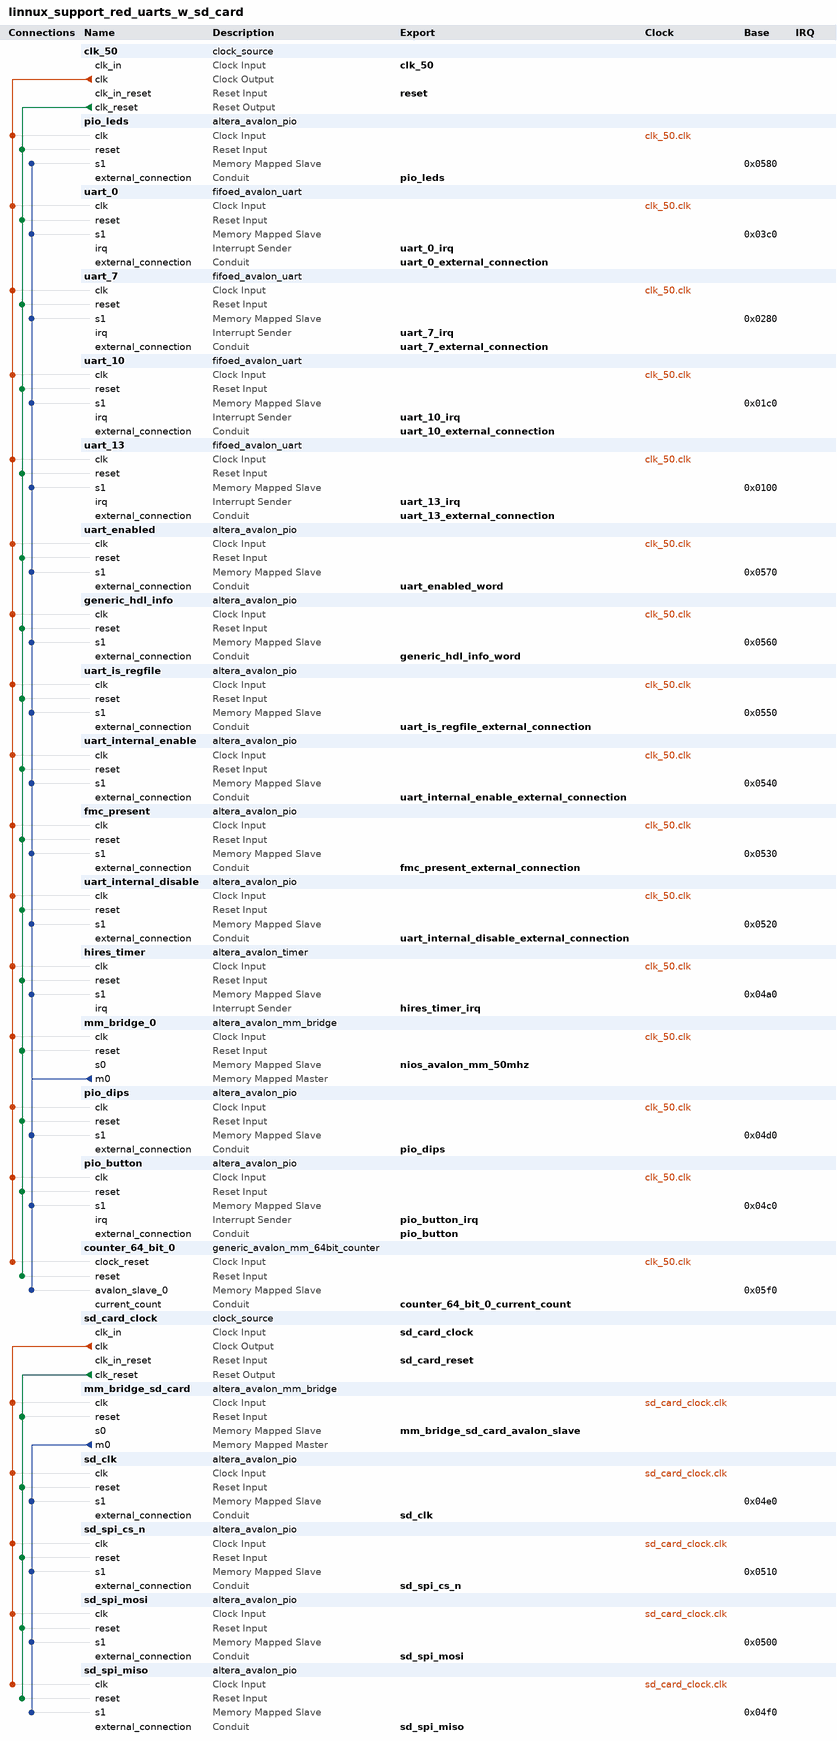
[diagram p0: system contents]
# Platform Designer (Qsys) system linnux_support_red_uarts_w_sd_card, Stratix IV EP4SGX530KH40C2
# Parameters at their usual value, and those the tool derives, are not listed.
package require -exact qsys 16.1
create_system linnux_support_red_uarts_w_sd_card
set_project_property DEVICE_FAMILY {Stratix IV}
set_project_property DEVICE EP4SGX530KH40C2

add_instance clk_50 clock_source 16.1
set_instance_parameter_value clk_50 clockFrequency 50000000
set_instance_parameter_value clk_50 resetSynchronousEdges BOTH

add_instance pio_leds altera_avalon_pio 16.1
set_instance_parameter_value pio_leds direction Output
set_instance_parameter_value pio_leds width 9

add_instance uart_0 fifoed_avalon_uart 13.1
set_instance_parameter_value uart_0 add_error_bits false
set_instance_parameter_value uart_0 baud 2000000
set_instance_parameter_value uart_0 dataBits 8
set_instance_parameter_value uart_0 driver_pass_error_bits false
set_instance_parameter_value uart_0 export_handshake false
set_instance_parameter_value uart_0 fifo_export_used false
set_instance_parameter_value uart_0 fifo_size_rx 128
set_instance_parameter_value uart_0 fifo_size_tx 128
set_instance_parameter_value uart_0 fixedBaud false
set_instance_parameter_value uart_0 gap_value 4
set_instance_parameter_value uart_0 hw_cts false
set_instance_parameter_value uart_0 parity NONE
set_instance_parameter_value uart_0 rx_IRQ_Threshold 1
set_instance_parameter_value uart_0 rx_fifo_LE false
set_instance_parameter_value uart_0 simInteractiveInputEnable false
set_instance_parameter_value uart_0 simInteractiveOutputEnable false
set_instance_parameter_value uart_0 simTrueBaud false
set_instance_parameter_value uart_0 stopBits 1
set_instance_parameter_value uart_0 syncRegDepth 2
set_instance_parameter_value uart_0 timeout_value 20
set_instance_parameter_value uart_0 timestamp_width 8
set_instance_parameter_value uart_0 trans_pin false
set_instance_parameter_value uart_0 tx_IRQ_Threshold 1
set_instance_parameter_value uart_0 tx_fifo_LE false
set_instance_parameter_value uart_0 useCtsRts false
set_instance_parameter_value uart_0 useEopRegister false
set_instance_parameter_value uart_0 useRelativePathForSimFile false
set_instance_parameter_value uart_0 use_ext_timestamp false
set_instance_parameter_value uart_0 use_gap_detection false
set_instance_parameter_value uart_0 use_rx_fifo true
set_instance_parameter_value uart_0 use_status_bit_clear false
set_instance_parameter_value uart_0 use_timestamp false
set_instance_parameter_value uart_0 use_timout false
set_instance_parameter_value uart_0 use_tx_fifo true

add_instance uart_7 fifoed_avalon_uart 13.1
set_instance_parameter_value uart_7 add_error_bits false
set_instance_parameter_value uart_7 baud 2000000
set_instance_parameter_value uart_7 dataBits 8
set_instance_parameter_value uart_7 driver_pass_error_bits false
set_instance_parameter_value uart_7 export_handshake false
set_instance_parameter_value uart_7 fifo_export_used false
set_instance_parameter_value uart_7 fifo_size_rx 128
set_instance_parameter_value uart_7 fifo_size_tx 128
set_instance_parameter_value uart_7 fixedBaud true
set_instance_parameter_value uart_7 gap_value 4
set_instance_parameter_value uart_7 hw_cts false
set_instance_parameter_value uart_7 parity NONE
set_instance_parameter_value uart_7 rx_IRQ_Threshold 1
set_instance_parameter_value uart_7 rx_fifo_LE false
set_instance_parameter_value uart_7 simInteractiveInputEnable false
set_instance_parameter_value uart_7 simInteractiveOutputEnable false
set_instance_parameter_value uart_7 simTrueBaud false
set_instance_parameter_value uart_7 stopBits 1
set_instance_parameter_value uart_7 syncRegDepth 2
set_instance_parameter_value uart_7 timeout_value 20
set_instance_parameter_value uart_7 timestamp_width 8
set_instance_parameter_value uart_7 trans_pin false
set_instance_parameter_value uart_7 tx_IRQ_Threshold 1
set_instance_parameter_value uart_7 tx_fifo_LE false
set_instance_parameter_value uart_7 useCtsRts false
set_instance_parameter_value uart_7 useEopRegister false
set_instance_parameter_value uart_7 useRelativePathForSimFile false
set_instance_parameter_value uart_7 use_ext_timestamp false
set_instance_parameter_value uart_7 use_gap_detection false
set_instance_parameter_value uart_7 use_rx_fifo true
set_instance_parameter_value uart_7 use_status_bit_clear false
set_instance_parameter_value uart_7 use_timestamp false
set_instance_parameter_value uart_7 use_timout false
set_instance_parameter_value uart_7 use_tx_fifo true

add_instance uart_10 fifoed_avalon_uart 13.1
set_instance_parameter_value uart_10 add_error_bits false
set_instance_parameter_value uart_10 baud 2000000
set_instance_parameter_value uart_10 dataBits 8
set_instance_parameter_value uart_10 driver_pass_error_bits false
set_instance_parameter_value uart_10 export_handshake false
set_instance_parameter_value uart_10 fifo_export_used false
set_instance_parameter_value uart_10 fifo_size_rx 128
set_instance_parameter_value uart_10 fifo_size_tx 128
set_instance_parameter_value uart_10 fixedBaud true
set_instance_parameter_value uart_10 gap_value 4
set_instance_parameter_value uart_10 hw_cts false
set_instance_parameter_value uart_10 parity NONE
set_instance_parameter_value uart_10 rx_IRQ_Threshold 1
set_instance_parameter_value uart_10 rx_fifo_LE false
set_instance_parameter_value uart_10 simInteractiveInputEnable false
set_instance_parameter_value uart_10 simInteractiveOutputEnable false
set_instance_parameter_value uart_10 simTrueBaud false
set_instance_parameter_value uart_10 stopBits 1
set_instance_parameter_value uart_10 syncRegDepth 2
set_instance_parameter_value uart_10 timeout_value 20
set_instance_parameter_value uart_10 timestamp_width 8
set_instance_parameter_value uart_10 trans_pin false
set_instance_parameter_value uart_10 tx_IRQ_Threshold 1
set_instance_parameter_value uart_10 tx_fifo_LE false
set_instance_parameter_value uart_10 useCtsRts false
set_instance_parameter_value uart_10 useEopRegister false
set_instance_parameter_value uart_10 useRelativePathForSimFile false
set_instance_parameter_value uart_10 use_ext_timestamp false
set_instance_parameter_value uart_10 use_gap_detection false
set_instance_parameter_value uart_10 use_rx_fifo true
set_instance_parameter_value uart_10 use_status_bit_clear false
set_instance_parameter_value uart_10 use_timestamp false
set_instance_parameter_value uart_10 use_timout false
set_instance_parameter_value uart_10 use_tx_fifo true

add_instance uart_13 fifoed_avalon_uart 13.1
set_instance_parameter_value uart_13 add_error_bits false
set_instance_parameter_value uart_13 baud 2000000
set_instance_parameter_value uart_13 dataBits 8
set_instance_parameter_value uart_13 driver_pass_error_bits false
set_instance_parameter_value uart_13 export_handshake false
set_instance_parameter_value uart_13 fifo_export_used false
set_instance_parameter_value uart_13 fifo_size_rx 128
set_instance_parameter_value uart_13 fifo_size_tx 128
set_instance_parameter_value uart_13 fixedBaud true
set_instance_parameter_value uart_13 gap_value 4
set_instance_parameter_value uart_13 hw_cts false
set_instance_parameter_value uart_13 parity NONE
set_instance_parameter_value uart_13 rx_IRQ_Threshold 1
set_instance_parameter_value uart_13 rx_fifo_LE false
set_instance_parameter_value uart_13 simInteractiveInputEnable false
set_instance_parameter_value uart_13 simInteractiveOutputEnable false
set_instance_parameter_value uart_13 simTrueBaud false
set_instance_parameter_value uart_13 stopBits 1
set_instance_parameter_value uart_13 syncRegDepth 2
set_instance_parameter_value uart_13 timeout_value 20
set_instance_parameter_value uart_13 timestamp_width 8
set_instance_parameter_value uart_13 trans_pin false
set_instance_parameter_value uart_13 tx_IRQ_Threshold 1
set_instance_parameter_value uart_13 tx_fifo_LE false
set_instance_parameter_value uart_13 useCtsRts false
set_instance_parameter_value uart_13 useEopRegister false
set_instance_parameter_value uart_13 useRelativePathForSimFile false
set_instance_parameter_value uart_13 use_ext_timestamp false
set_instance_parameter_value uart_13 use_gap_detection false
set_instance_parameter_value uart_13 use_rx_fifo true
set_instance_parameter_value uart_13 use_status_bit_clear false
set_instance_parameter_value uart_13 use_timestamp false
set_instance_parameter_value uart_13 use_timout false
set_instance_parameter_value uart_13 use_tx_fifo true

add_instance uart_enabled altera_avalon_pio 16.1
set_instance_parameter_value uart_enabled direction Input
set_instance_parameter_value uart_enabled width 32

add_instance generic_hdl_info altera_avalon_pio 16.1
set_instance_parameter_value generic_hdl_info direction Input
set_instance_parameter_value generic_hdl_info width 32

add_instance uart_is_regfile altera_avalon_pio 16.1
set_instance_parameter_value uart_is_regfile direction Input
set_instance_parameter_value uart_is_regfile width 32

add_instance uart_internal_enable altera_avalon_pio 16.1
set_instance_parameter_value uart_internal_enable direction Output
set_instance_parameter_value uart_internal_enable width 32

add_instance fmc_present altera_avalon_pio 16.1
set_instance_parameter_value fmc_present direction Input
set_instance_parameter_value fmc_present width 16

add_instance uart_internal_disable altera_avalon_pio 16.1
set_instance_parameter_value uart_internal_disable direction Output
set_instance_parameter_value uart_internal_disable width 32

add_instance hires_timer altera_avalon_timer 16.1
set_instance_parameter_value hires_timer period 1
set_instance_parameter_value hires_timer periodUnits MSEC

add_instance mm_bridge_0 altera_avalon_mm_bridge 16.1
set_instance_parameter_value mm_bridge_0 ADDRESS_UNITS SYMBOLS
set_instance_parameter_value mm_bridge_0 ADDRESS_WIDTH 27
set_instance_parameter_value mm_bridge_0 DATA_WIDTH 32
set_instance_parameter_value mm_bridge_0 MAX_PENDING_RESPONSES 4
set_instance_parameter_value mm_bridge_0 USE_AUTO_ADDRESS_WIDTH 1

add_instance pio_dips altera_avalon_pio 16.1
set_instance_parameter_value pio_dips direction Input
set_instance_parameter_value pio_dips width 8

add_instance pio_button altera_avalon_pio 16.1
set_instance_parameter_value pio_button captureEdge true
set_instance_parameter_value pio_button direction Input
set_instance_parameter_value pio_button generateIRQ true
set_instance_parameter_value pio_button irqType EDGE
set_instance_parameter_value pio_button width 8

add_instance counter_64_bit_0 generic_avalon_mm_64bit_counter 2.0

add_instance sd_card_clock clock_source 16.1
set_instance_parameter_value sd_card_clock clockFrequency 50000000
set_instance_parameter_value sd_card_clock clockFrequencyKnown false
set_instance_parameter_value sd_card_clock resetSynchronousEdges BOTH

add_instance mm_bridge_sd_card altera_avalon_mm_bridge 16.1
set_instance_parameter_value mm_bridge_sd_card ADDRESS_UNITS SYMBOLS
set_instance_parameter_value mm_bridge_sd_card ADDRESS_WIDTH 27
set_instance_parameter_value mm_bridge_sd_card DATA_WIDTH 32
set_instance_parameter_value mm_bridge_sd_card MAX_PENDING_RESPONSES 4
set_instance_parameter_value mm_bridge_sd_card USE_AUTO_ADDRESS_WIDTH 1

add_instance sd_clk altera_avalon_pio 16.1
set_instance_parameter_value sd_clk direction Output
set_instance_parameter_value sd_clk width 1

add_instance sd_spi_cs_n altera_avalon_pio 16.1
set_instance_parameter_value sd_spi_cs_n direction Output
set_instance_parameter_value sd_spi_cs_n resetValue 1
set_instance_parameter_value sd_spi_cs_n width 1

add_instance sd_spi_mosi altera_avalon_pio 16.1
set_instance_parameter_value sd_spi_mosi direction Output
set_instance_parameter_value sd_spi_mosi resetValue 1
set_instance_parameter_value sd_spi_mosi width 1

add_instance sd_spi_miso altera_avalon_pio 16.1
set_instance_parameter_value sd_spi_miso direction Input
set_instance_parameter_value sd_spi_miso width 1

# connections
add_connection clk_50.clk counter_64_bit_0.clock_reset clock
add_connection clk_50.clk fmc_present.clk clock
add_connection clk_50.clk generic_hdl_info.clk clock
add_connection clk_50.clk hires_timer.clk clock
add_connection clk_50.clk mm_bridge_0.clk clock
add_connection clk_50.clk pio_button.clk clock
add_connection clk_50.clk pio_dips.clk clock
add_connection clk_50.clk pio_leds.clk clock
add_connection clk_50.clk uart_0.clk clock
add_connection clk_50.clk uart_7.clk clock
add_connection clk_50.clk uart_10.clk clock
add_connection clk_50.clk uart_13.clk clock
add_connection clk_50.clk uart_enabled.clk clock
add_connection clk_50.clk uart_internal_disable.clk clock
add_connection clk_50.clk uart_internal_enable.clk clock
add_connection clk_50.clk uart_is_regfile.clk clock
add_connection sd_card_clock.clk mm_bridge_sd_card.clk clock
add_connection sd_card_clock.clk sd_clk.clk clock
add_connection sd_card_clock.clk sd_spi_cs_n.clk clock
add_connection sd_card_clock.clk sd_spi_miso.clk clock
add_connection sd_card_clock.clk sd_spi_mosi.clk clock
add_connection clk_50.clk_reset counter_64_bit_0.reset reset
add_connection clk_50.clk_reset fmc_present.reset reset
add_connection clk_50.clk_reset generic_hdl_info.reset reset
add_connection clk_50.clk_reset hires_timer.reset reset
add_connection clk_50.clk_reset mm_bridge_0.reset reset
add_connection clk_50.clk_reset pio_button.reset reset
add_connection clk_50.clk_reset pio_dips.reset reset
add_connection clk_50.clk_reset pio_leds.reset reset
add_connection clk_50.clk_reset uart_0.reset reset
add_connection clk_50.clk_reset uart_7.reset reset
add_connection clk_50.clk_reset uart_10.reset reset
add_connection clk_50.clk_reset uart_13.reset reset
add_connection clk_50.clk_reset uart_enabled.reset reset
add_connection clk_50.clk_reset uart_internal_disable.reset reset
add_connection clk_50.clk_reset uart_internal_enable.reset reset
add_connection clk_50.clk_reset uart_is_regfile.reset reset
add_connection sd_card_clock.clk_reset mm_bridge_sd_card.reset reset
add_connection sd_card_clock.clk_reset sd_clk.reset reset
add_connection sd_card_clock.clk_reset sd_spi_cs_n.reset reset
add_connection sd_card_clock.clk_reset sd_spi_miso.reset reset
add_connection sd_card_clock.clk_reset sd_spi_mosi.reset reset
add_connection mm_bridge_0.m0 counter_64_bit_0.avalon_slave_0 avalon
set_connection_parameter_value mm_bridge_0.m0/counter_64_bit_0.avalon_slave_0 baseAddress 0x05f0
add_connection mm_bridge_0.m0 fmc_present.s1 avalon
set_connection_parameter_value mm_bridge_0.m0/fmc_present.s1 baseAddress 0x0530
add_connection mm_bridge_0.m0 generic_hdl_info.s1 avalon
set_connection_parameter_value mm_bridge_0.m0/generic_hdl_info.s1 baseAddress 0x0560
add_connection mm_bridge_0.m0 hires_timer.s1 avalon
set_connection_parameter_value mm_bridge_0.m0/hires_timer.s1 baseAddress 0x04a0
add_connection mm_bridge_0.m0 pio_button.s1 avalon
set_connection_parameter_value mm_bridge_0.m0/pio_button.s1 baseAddress 0x04c0
add_connection mm_bridge_0.m0 pio_dips.s1 avalon
set_connection_parameter_value mm_bridge_0.m0/pio_dips.s1 baseAddress 0x04d0
add_connection mm_bridge_0.m0 pio_leds.s1 avalon
set_connection_parameter_value mm_bridge_0.m0/pio_leds.s1 baseAddress 0x0580
add_connection mm_bridge_0.m0 uart_0.s1 avalon
set_connection_parameter_value mm_bridge_0.m0/uart_0.s1 baseAddress 0x03c0
add_connection mm_bridge_0.m0 uart_7.s1 avalon
set_connection_parameter_value mm_bridge_0.m0/uart_7.s1 baseAddress 0x0280
add_connection mm_bridge_0.m0 uart_10.s1 avalon
set_connection_parameter_value mm_bridge_0.m0/uart_10.s1 baseAddress 0x01c0
add_connection mm_bridge_0.m0 uart_13.s1 avalon
set_connection_parameter_value mm_bridge_0.m0/uart_13.s1 baseAddress 0x0100
add_connection mm_bridge_0.m0 uart_enabled.s1 avalon
set_connection_parameter_value mm_bridge_0.m0/uart_enabled.s1 baseAddress 0x0570
add_connection mm_bridge_0.m0 uart_internal_disable.s1 avalon
set_connection_parameter_value mm_bridge_0.m0/uart_internal_disable.s1 baseAddress 0x0520
add_connection mm_bridge_0.m0 uart_internal_enable.s1 avalon
set_connection_parameter_value mm_bridge_0.m0/uart_internal_enable.s1 baseAddress 0x0540
add_connection mm_bridge_0.m0 uart_is_regfile.s1 avalon
set_connection_parameter_value mm_bridge_0.m0/uart_is_regfile.s1 baseAddress 0x0550
add_connection mm_bridge_sd_card.m0 sd_clk.s1 avalon
set_connection_parameter_value mm_bridge_sd_card.m0/sd_clk.s1 baseAddress 0x04e0
add_connection mm_bridge_sd_card.m0 sd_spi_cs_n.s1 avalon
set_connection_parameter_value mm_bridge_sd_card.m0/sd_spi_cs_n.s1 baseAddress 0x0510
add_connection mm_bridge_sd_card.m0 sd_spi_miso.s1 avalon
set_connection_parameter_value mm_bridge_sd_card.m0/sd_spi_miso.s1 baseAddress 0x04f0
add_connection mm_bridge_sd_card.m0 sd_spi_mosi.s1 avalon
set_connection_parameter_value mm_bridge_sd_card.m0/sd_spi_mosi.s1 baseAddress 0x0500

# exported interfaces
add_interface clk_50 clock sink
set_interface_property clk_50 EXPORT_OF clk_50.clk_in
add_interface counter_64_bit_0_current_count conduit end
set_interface_property counter_64_bit_0_current_count EXPORT_OF counter_64_bit_0.current_count
add_interface fmc_present_external_connection conduit end
set_interface_property fmc_present_external_connection EXPORT_OF fmc_present.external_connection
add_interface generic_hdl_info_word conduit end
set_interface_property generic_hdl_info_word EXPORT_OF generic_hdl_info.external_connection
add_interface hires_timer_irq interrupt sender
set_interface_property hires_timer_irq EXPORT_OF hires_timer.irq
add_interface mm_bridge_sd_card_avalon_slave avalon slave
set_interface_property mm_bridge_sd_card_avalon_slave EXPORT_OF mm_bridge_sd_card.s0
add_interface nios_avalon_mm_50mhz avalon slave
set_interface_property nios_avalon_mm_50mhz EXPORT_OF mm_bridge_0.s0
add_interface pio_button conduit end
set_interface_property pio_button EXPORT_OF pio_button.external_connection
add_interface pio_button_irq interrupt sender
set_interface_property pio_button_irq EXPORT_OF pio_button.irq
add_interface pio_dips conduit end
set_interface_property pio_dips EXPORT_OF pio_dips.external_connection
add_interface pio_leds conduit end
set_interface_property pio_leds EXPORT_OF pio_leds.external_connection
add_interface reset reset sink
set_interface_property reset EXPORT_OF clk_50.clk_in_reset
add_interface sd_card_clock clock sink
set_interface_property sd_card_clock EXPORT_OF sd_card_clock.clk_in
add_interface sd_card_reset reset sink
set_interface_property sd_card_reset EXPORT_OF sd_card_clock.clk_in_reset
add_interface sd_clk conduit end
set_interface_property sd_clk EXPORT_OF sd_clk.external_connection
add_interface sd_spi_cs_n conduit end
set_interface_property sd_spi_cs_n EXPORT_OF sd_spi_cs_n.external_connection
add_interface sd_spi_miso conduit end
set_interface_property sd_spi_miso EXPORT_OF sd_spi_miso.external_connection
add_interface sd_spi_mosi conduit end
set_interface_property sd_spi_mosi EXPORT_OF sd_spi_mosi.external_connection
add_interface uart_0_external_connection conduit end
set_interface_property uart_0_external_connection EXPORT_OF uart_0.external_connection
add_interface uart_0_irq interrupt sender
set_interface_property uart_0_irq EXPORT_OF uart_0.irq
add_interface uart_10_external_connection conduit end
set_interface_property uart_10_external_connection EXPORT_OF uart_10.external_connection
add_interface uart_10_irq interrupt sender
set_interface_property uart_10_irq EXPORT_OF uart_10.irq
add_interface uart_13_external_connection conduit end
set_interface_property uart_13_external_connection EXPORT_OF uart_13.external_connection
add_interface uart_13_irq interrupt sender
set_interface_property uart_13_irq EXPORT_OF uart_13.irq
add_interface uart_7_external_connection conduit end
set_interface_property uart_7_external_connection EXPORT_OF uart_7.external_connection
add_interface uart_7_irq interrupt sender
set_interface_property uart_7_irq EXPORT_OF uart_7.irq
add_interface uart_enabled_word conduit end
set_interface_property uart_enabled_word EXPORT_OF uart_enabled.external_connection
add_interface uart_internal_disable_external_connection conduit end
set_interface_property uart_internal_disable_external_connection EXPORT_OF uart_internal_disable.external_connection
add_interface uart_internal_enable_external_connection conduit end
set_interface_property uart_internal_enable_external_connection EXPORT_OF uart_internal_enable.external_connection
add_interface uart_is_regfile_external_connection conduit end
set_interface_property uart_is_regfile_external_connection EXPORT_OF uart_is_regfile.external_connection

set_interconnect_requirement {$system} qsys_mm.clockCrossingAdapter AUTO
set_interconnect_requirement {$system} qsys_mm.maxAdditionalLatency 1

save_system linnux_support_red_uarts_w_sd_card.qsys
